# EasyEDA Pro project ProPrj_Motor Driver Board v5.3.7.epro, board PCB1
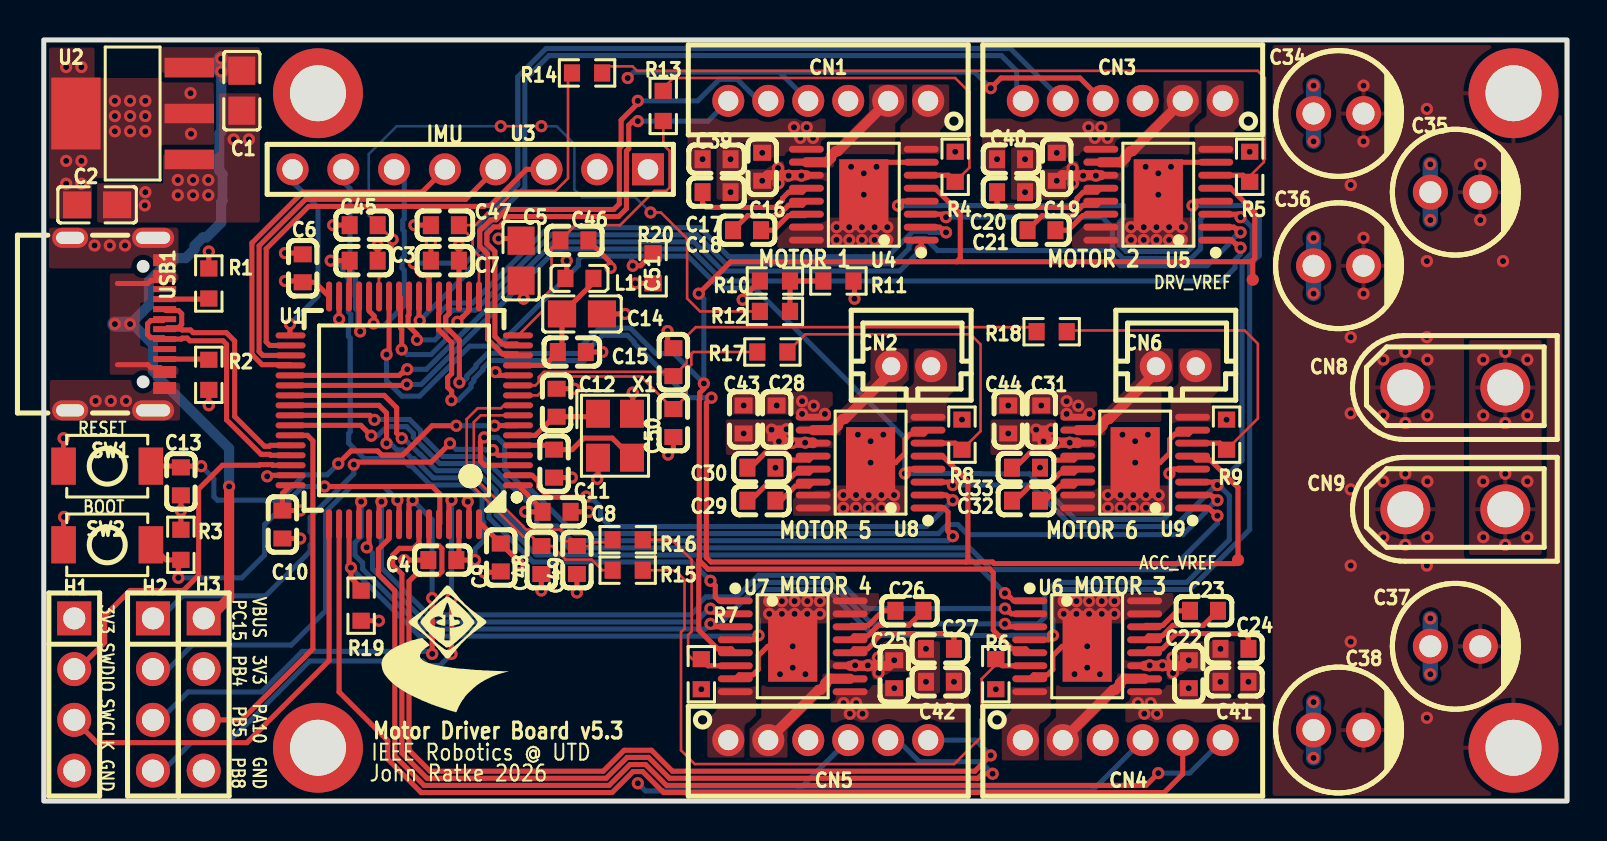
[diagram p8: board, top side]
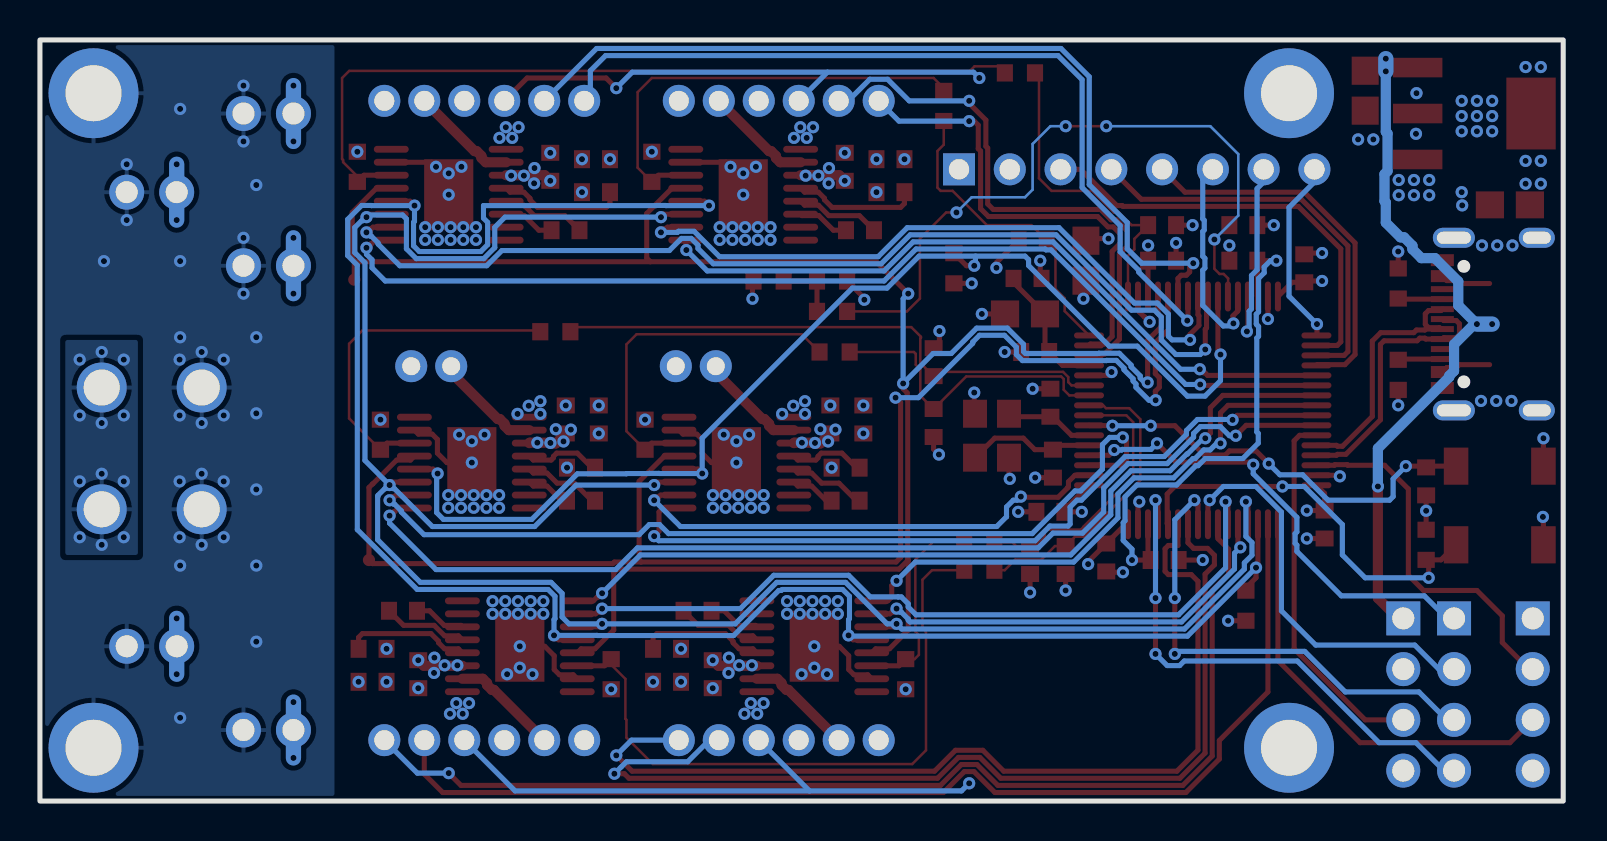
[diagram p9: board, bottom side, seen from below]

Outline 76.2 x 38.1 mm; copper layers: Top Layer, Inner1, Inner2, Bottom Layer. Coordinates in mm from the lower left corner of the outline.
Outline path: rectangle 0,38.1 76.2,0
Stack: Top Layer 0.035mm Outer layer thickness 1oz / Dielectric1 0.2104mm 7628 RC49% 8.6mil / Inner1 0.0152mm Inner layer thickness / Dielectric2 1.065mm 1.1mm H/HOZ Copper / Inner2 0.0152mm Inner layer thickness / Dielectric3 0.2104mm 7628 RC49% 8.6mil / Bottom Layer 0.035mm Outer layer thickness 1oz

## Design rules (mm)
net USB_DN: DP1
net USB_DP: DP1
template: Custom Config
spacing copperThickness1oz (default): track to track 0.102, other pairs 0.152 to 0.3
spacing copperThickness2oz: track to track 0.203, other pairs 0.152 to 0.3
track width copperThickness1oz (default): min 0.127, default 0.254, max 2.54
track width copperThickness2oz: min 0.203, default 0.254, max 2.54
differential pair differentialPair (default): width min 0.127, default 0.254, max 2.54; gap min 0.152, default 0.152
via viaSize (default): diameter min 0.5, default 0.61, max 10; hole min 0.3, default 0.305, max 6.3
pour e2389 uses throughhole
pour e4841 uses throughhole
pour e2168 uses throughhole
pour e1991 uses throughhole

## Placement (name value [footprint] x y rotation side)
C1  10uF  [C0805]  9.91 35.56 90 top
C2  10uF  [C0805]  2.67 29.84 180 top
C3  2.2uF  [C0603]  16 27.05 180 top
C4  2.2uF  [C0603]  19.94 12.06 180 top
C5  10uF  [C0805]  23.88 27.05 270 top
C6  100nF  [C0603]  12.95 26.67 270 top
C7  100nF  [C0603]  20.07 27.05 0 top
C8  100nF  [C0603]  25.65 14.48 180 top
C9  100nF  [C0603]  22.86 12.19 90 top
C10  100nF  [C0603]  11.94 13.84 90 top
C11  22pF  [C0603]  25.53 16.89 90 top
C12  22pF  [C0603]  25.65 19.94 90 top
C13  100nF  [C0603]  6.86 16 270 top
C14  10uF  [C0805]  26.92 24.38 180 top
C15  100nF  [C0603]  26.42 22.48 180 top
C16  100nF  [C0603]  35.94 31.75 90 top
C17  22nF  [C0603]  35.18 28.57 180 top
C18  100nF  [C0603]  33.66 30.48 0 top
C19  100nF  [C0603]  50.67 31.75 90 top
C20  22nF  [C0603]  49.91 28.57 180 top
C21  100nF  [C0603]  48.39 30.48 0 top
C22  100nF  [C0603]  57.28 6.35 270 top
C23  22nF  [C0603]  58.04 9.52 0 top
C24  100nF  [C0603]  59.56 7.62 180 top
C25  100nF  [C0603]  42.54 6.35 270 top
C26  22nF  [C0603]  43.31 9.52 0 top
C27  100nF  [C0603]  44.83 7.62 180 top
C28  100nF  [C0603]  36.66 19.1 90 top
C29  22nF  [C0603]  35.9 15.04 180 top
C30  100nF  [C0603]  35.9 16.69 0 top
C31  100nF  [C0603]  49.9 19.1 90 top
C32  22nF  [C0603]  49.14 15.04 180 top
C33  100nF  [C0603]  49.14 16.69 0 top
C34  470uF  [CAP-TH_BD6.3-P2.50-D0.6-FD-1]  64.77 34.42 0 top
C35  470uF  [CAP-TH_BD6.3-P2.50-D0.6-FD-1]  70.61 30.48 0 top
C36  470uF  [CAP-TH_BD6.3-P2.50-D0.6-FD-1]  64.77 26.8 0 top
C37  470uF  [CAP-TH_BD6.3-P2.50-D0.6-FD-1]  70.61 7.75 0 top
C38  470uF  [CAP-TH_BD6.3-P2.50-D0.6-FD-1]  64.77 3.56 0 top
C39  1uF  [C0603]  33.66 32.13 0 top
C40  1uF  [C0603]  48.39 32.13 0 top
C41  1uF  [C0603]  59.56 5.97 180 top
C42  1uF  [C0603]  44.83 5.97 180 top
C43  1uF  [C0603]  35.01 19.1 270 top
C44  1uF  [C0603]  48.25 19.1 270 top
C45  100nF  [C0603]  16 28.83 0 top
C46  100nF  [C0603]  26.54 28.07 180 top
C47  100nF  [C0603]  20.07 28.83 0 top
C48  100nF  [C0603]  24.89 12.06 90 top
C49  100nF  [C0603]  26.67 12.06 90 top
C50  100nF  [C0603]  31.5 18.92 90 top
C51  100nF  [C0603]  31.5 21.97 270 top
CN1  B6B-PH-K-S(LF)(SN)  [CONN-TH_B6B-PH-K-S]  39.24 35.05 0 top
CN2  B2B-PH-K-S(LF)(SN)  [CONN-TH_B2B-PH-K-S]  43.39 21.77 0 top
CN3  B6B-PH-K-S(LF)(SN)  [CONN-TH_B6B-PH-K-S]  53.97 35.05 0 top
CN4  B6B-PH-K-S(LF)(SN)  [CONN-TH_B6B-PH-K-S]  53.97 3.05 180 top
CN5  B6B-PH-K-S(LF)(SN)  [CONN-TH_B6B-PH-K-S]  39.24 3.05 180 top
CN6  B2B-PH-K-S(LF)(SN)  [CONN-TH_B2B-PH-K-S]  56.63 21.77 0 top
CN8  XT30UPB-M  [CONN-TH_XT30UPB-M]  70.61 20.7 0 top
CN9  XT30UPB-M  [CONN-TH_XT30UPB-M]  70.61 14.6 0 top
H1  PZ254V-11-04P  [HDR-TH_4P-P2.54-V-M]  1.52 5.33 270 top
H2  PZ254V-11-04P  [HDR-TH_4P-P2.54-V-M]  5.46 5.33 270 top
H3  PZ254V-11-04P  [HDR-TH_4P-P2.54-V-M]  8 5.33 270 top
L1  BLM18KG601SN1D  [L0603]  26.8 26.16 0 top
NOREF  -  [Pad_e130]  13.72 2.67 0 top
NOREF#2  -  [Pad_e140]  73.52 35.43 0 top
NOREF#3  -  [Pad_e1721]  60.48 26.1 0 top
NOREF#4  -  [Pad_e139]  13.72 35.43 0 top
NOREF#5  -  [Pad_e141]  73.52 2.67 0 top
NOREF#6  -  [Pad_e1714]  59.74 12.06 0 top
R1  5.1kΩ  [R0603]  8.25 25.91 90 top
R2  5.1kΩ  [R0603]  8.25 21.34 270 top
R3  5.1kΩ  [R0603]  6.86 12.83 90 top
R4  1kΩ  [R0603]  45.59 31.75 270 top
R5  1kΩ  [R0603]  60.32 31.75 270 top
R6  1kΩ  [R0603]  47.62 6.35 90 top
R7  1kΩ  [R0603]  32.89 6.35 90 top
R8  1kΩ  [R0603]  45.93 18.34 270 top
R9  1kΩ  [R0603]  59.17 18.34 270 top
R10  22kΩ  [R0603]  36.58 26.03 0 top
R11  100kΩ  [R0603]  39.75 26.03 0 top
R12  1kΩ  [R0603]  36.58 24.51 180 top
R13  1kΩ  [R0603]  30.99 34.8 90 top
R14  1kΩ  [R0603]  27.18 36.45 0 top
R15  1kΩ  [R0603]  29.21 11.56 0 top
R16  1kΩ  [R0603]  29.21 13.08 0 top
R17  1kΩ  [R0603]  36.45 22.48 0 top
R18  1kΩ  [R0603]  50.42 23.49 0 top
R19  5.1kΩ  [R0603]  15.88 9.78 90 top
R20  5.1kΩ  [R0603]  30.48 26.67 90 top
SW1  TS-1088-AR02016  [SW-SMD_L3.9-W3.0-P4.45]  3.17 16.76 0 top
SW2  TS-1088-AR02016  [SW-SMD_L3.9-W3.0-P4.45]  3.17 12.83 0 top
U1  STM32H562RGT6  [LQFP-64_L10.0-W10.0-P0.50-LS12.0-BL]  18.03 19.56 90 top
U2  AMS1117-3.3  [SOT-223-4_L6.5-W3.5-P2.30-LS7.0-BR]  4.44 34.42 0 top
U3  B25420220-8PB0513-H85C32  [HDR-TH_B25420220-8PB0513-H85C32]  21.34 31.62 180 top
U4  DRV8874PWPR  [HTSSOP-16_L5.0-W4.4-P0.65-LS6.4-BL-EP]  41.02 30.35 90 top
U5  DRV8874PWPR  [HTSSOP-16_L5.0-W4.4-P0.65-LS6.4-BL-EP]  55.75 30.35 90 top
U6  DRV8874PWPR  [HTSSOP-16_L5.0-W4.4-P0.65-LS6.4-BL-EP]  52.2 7.75 270 top
U7  DRV8874PWPR  [HTSSOP-16_L5.0-W4.4-P0.65-LS6.4-BL-EP]  37.47 7.75 270 top
U8  DRV8874PWPR  [HTSSOP-16_L5.0-W4.4-P0.65-LS6.4-BL-EP]  41.36 16.94 90 top
U9  DRV8874PWPR  [HTSSOP-16_L5.0-W4.4-P0.65-LS6.4-BL-EP]  54.6 16.94 90 top
USB1  TYPE-C16PIN  [USB-C-SMD_TYPE-C16PIN]  3.68 23.88 270 top
X1  25MHz  [CRYSTAL-SMD_4P-L3.2-W2.5-BL]  28.57 18.29 270 top

## Footprints (pads in the part's own frame, mm; a bottom-side part is the same pattern mirrored in y, then rotated)
C0603
  rect 0.8x0.9 smd: 1(-0.7,0) 2(0.7,0)
C0805
  rect 1.41x1.35 smd: 1(-1,0) 2(1,0)
CAP-TH_BD6.3-P2.50-D0.6-FD-1
  round 1.75 hole 1.1: 1(-1.25,0) 2(1.25,0)
CONN-TH_B2B-PH-K-S
  round 1.6 hole 0.9: 1(1,0) 2(-1,0)
CONN-TH_B6B-PH-K-S
  round 1.6 hole 1: 1(5,0) 2(3,0) 3(1,0) 4(-1,0) 5(-3,0) 6(-5,0)
CONN-TH_XT30UPB-M
  round 2.5 hole 1.8: 1(-2.5,0) 2(2.5,0)
CRYSTAL-SMD_4P-L3.2-W2.5-BL
  rect 1.4x1.2 smd: 1(-1.1,-0.85) 2(1.1,-0.85) 3(1.1,0.85) 4(-1.1,0.85)
HDR-TH_4P-P2.54-V-M
  rect 1.7x1.7 hole 1.1: 1(-3.81,0)
  round 1.7 hole 1.1: 2(-1.27,0) 3(1.27,0) 4(3.81,0)
HDR-TH_B25420220-8PB0513-H85C32
  rect 1.6x1.6 hole 1.02: 1(-8.89,0)
  round 1.6 hole 1.02: 2(-6.35,0) 3(-3.81,0) 4(-1.27,0) 5(1.27,0) 6(3.81,0) 7(6.35,0) 8(8.89,0)
HTSSOP-16_L5.0-W4.4-P0.65-LS6.4-BL-EP
  oval 0.343x1.746 smd: 1(-2.275,-2.873) 2(-1.625,-2.873) 3(-0.975,-2.873) 4(-0.325,-2.873) 5(0.325,-2.873) 6(0.975,-2.873) 7(1.625,-2.873) 8(2.275,-2.873) 9(2.275,2.873) 10(1.625,2.873) 11(0.975,2.873) 12(0.325,2.873) 13(-0.325,2.873) 14(-0.975,2.873) 15(-1.625,2.873) 16(-2.275,2.873)
  rect 3.55x2.46 smd: 17(0,0)
L0603
  rect 0.8x0.864 smd: 1(-0.7,0) 2(0.7,0)
LQFP-64_L10.0-W10.0-P0.50-LS12.0-BL
  oval 0.3x1.5 smd: 1(-3.75,-5.688) 2(-3.25,-5.688) 3(-2.75,-5.688) 4(-2.25,-5.688) 5(-1.75,-5.688) 6(-1.25,-5.688) 7(-0.75,-5.688) 8(-0.25,-5.688) 9(0.25,-5.688) 10(0.75,-5.688) 11(1.25,-5.688) 12(1.75,-5.688) 13(2.25,-5.688) 14(2.75,-5.688) 15(3.25,-5.688) 16(3.75,-5.688) 33(3.75,5.688) 34(3.25,5.688) 35(2.75,5.688) 36(2.25,5.688) 37(1.75,5.688) 38(1.25,5.688) 39(0.75,5.688) 40(0.25,5.688) 41(-0.25,5.688) 42(-0.75,5.688) 43(-1.25,5.688) 44(-1.75,5.688) 45(-2.25,5.688) 46(-2.75,5.688) 47(-3.25,5.688) 48(-3.75,5.688)
  oval 1.5x0.3 smd: 17(5.7,-3.738) 18(5.7,-3.238) 19(5.7,-2.738) 20(5.7,-2.238) 21(5.7,-1.738) 22(5.7,-1.238) 23(5.7,-0.739) 24(5.7,-0.238) 25(5.7,0.262) 26(5.7,0.762) 27(5.7,1.262) 28(5.7,1.762) 29(5.7,2.261) 30(5.7,2.762) 31(5.7,3.261) 32(5.7,3.762) 49(-5.7,3.762) 50(-5.7,3.261) 51(-5.7,2.762) 52(-5.7,2.261) 53(-5.7,1.762) 54(-5.7,1.262) 55(-5.7,0.762) 56(-5.7,0.262) 57(-5.7,-0.238) 58(-5.7,-0.739) 59(-5.7,-1.238) 60(-5.7,-1.738) 61(-5.7,-2.238) 62(-5.7,-2.738) 63(-5.7,-3.238) 64(-5.7,-3.738)
Pad_e130
  round 4.501 hole 2.799: 1(0,0)
Pad_e139
  round 4.501 hole 2.799: 1(0,0)
Pad_e140
  round 4.501 hole 2.799: 1(0,0)
Pad_e141
  round 4.501 hole 2.799: 1(0,0)
Pad_e1714
  round 0.61 smd: TP1(0,0)
Pad_e1721
  round 0.61 smd: TP2(0,0)
R0603
  rect 0.806x0.864 smd: 1(-0.753,0) 2(0.753,0)
SOT-223-4_L6.5-W3.5-P2.30-LS7.0-BR
  rect 2.47x0.98 smd: 1(2.835,-2.3) 2(2.835,0) 3(2.835,2.3)
  rect 2.47x3.6 smd: 4(-2.835,0)
SW-SMD_L3.9-W3.0-P4.45
  rect 1.23x1.86 smd: 1(-2.185,0) 2(2.185,0)
USB-C-SMD_TYPE-C16PIN
  oval 1x2.1 hole 0.6x1.7: 1(-4.32,1.788) 2(4.32,1.788)
  oval 1x1.8 hole 0.6x1.4: 3(-4.32,-2.362) 4(4.32,-2.362)
  rect 0.6x1.15 smd: A1B12(-3.2,2.362) A4B9(-2.4,2.362) B1A12(3.2,2.362) B4A9(2.4,2.362)
  rect 0.3x1.15 smd: A5(-1.25,2.362) A6(-0.25,2.362) A7(0.25,2.362) A8(1.25,2.362) B5(1.75,2.362) B6(0.75,2.362) B7(-0.75,2.362) B8(-1.75,2.362)

## Nets
3V3: C2.2 C5.2 C6.2 C7.2 C8.2 C9.2 C10.2 CN1.4 CN3.4 CN4.4 CN5.4 H1.1 H3.2 L1.1 R19.1 R20.1 SW2.1 U1.1 U1.19 U1.32 U1.48 U1.64 U2.2 U2.4 U3.1
3V3A: C14.2 C15.2 L1.2 U1.13
GND: C1.1 C2.1 C3.1 C4.2 C5.1 C6.1 C7.1 C8.1 C9.1 C10.1 C11.1 C12.2 C13.2 C14.1 C15.1 C16.2 C19.2 C22.2 C25.2 C28.2 C31.2 C34.2 C35.2 C36.2 C37.2 C38.2 C39.1 C40.1 C41.1 C42.1 C43.1 C44.1 C45.1 C46.1 C47.1 C48.1 C49.1 C50.1 C51.1 CN1.3 CN3.3 CN4.3 CN5.3 CN8.1 CN9.1 H1.4 H3.4 NOREF.1 NOREF#2.1 NOREF#4.1 NOREF#5.1 R1.2 R2.2 R3.2 R4.1 R5.1 R6.1 R7.1 R8.1 R9.1 R10.1 SW1.1 U1.12 U1.18 U1.31 U1.47 U1.63 U2.1 U3.2 U4.7 U4.9 U4.15 U4.16 U4.17 U5.7 U5.9 U5.15 U5.16 U5.17 U6.7 U6.9 U6.15 U6.16 U6.17 U7.7 U7.9 U7.15 U7.16 U7.17 U8.7 U8.9 U8.15 U8.16 U8.17 U9.7 U9.9 U9.15 U9.16 U9.17 USB1.1 USB1.2 USB1.3 USB1.4 USB1.A1B12 USB1.B1A12 X1.2 X1.4
VBATT: C16.1 C18.2 C19.1 C21.2 C22.1 C24.2 C25.1 C27.2 C28.1 C30.2 C31.1 C33.2 C34.1 C35.1 C36.1 C37.1 C38.1 C39.2 C40.2 C41.2 C42.2 C43.2 C44.2 CN8.2 CN9.2 R11.2 U4.11 U5.11 U6.11 U7.11 U8.11 U9.11
VBATT_SENSE: C45.2 R12.2 U1.27
VBUS: C1.2 H3.1 U2.3 USB1.A4B9 USB1.B4A9
$2I4343\$1N607: C17.1 U4.14
$2I4343\$1N611: C17.2 U4.13
$2I4343\$1N695: C18.1 U4.12
$2I4343\OUT1: CN1.1 U4.8
$2I4343\OUT2: CN1.2 U4.10
$2I4381\$1N607: C20.1 U5.14
$2I4381\$1N611: C20.2 U5.13
$2I4381\$1N695: C21.1 U5.12
$2I4381\OUT1: CN3.1 U5.8
$2I4381\OUT2: CN3.2 U5.10
$2I4419\$1N607: C23.1 U6.14
$2I4419\$1N611: C23.2 U6.13
$2I4419\$1N695: C24.1 U6.12
$2I4419\OUT1: CN4.1 U6.8
$2I4419\OUT2: CN4.2 U6.10
$2I4457\$1N607: C26.1 U7.14
$2I4457\$1N611: C26.2 U7.13
$2I4457\$1N695: C27.1 U7.12
$2I4457\OUT1: CN5.1 U7.8
$2I4457\OUT2: CN5.2 U7.10
$2I4533\$1N607: C29.1 U8.14
$2I4533\$1N611: C29.2 U8.13
$2I4533\$1N695: C30.1 U8.12
$2I4533\OUT1: CN2.1 U8.8
$2I4533\OUT2: CN2.2 U8.10
$2I4563\$1N607: C32.1 U9.14
$2I4563\$1N611: C32.2 U9.13
$2I4563\$1N695: C33.1 U9.12
$2I4563\OUT1: CN6.1 U9.8
$2I4563\OUT2: CN6.2 U9.10
ACC_FAULT: R20.2 U1.26 U8.4 U9.4
ACC_VREF: NOREF#6.TP1 U1.21 U8.5 U9.5
BOOT0: R3.1 SW2.2 U1.60
DRV_FAULT: R19.2 U1.51 U4.4 U5.4 U6.4 U7.4
DRV_VREF: NOREF#3.TP2 U1.20 U4.5 U5.5 U6.5 U7.5
GPIO1: H2.1 U1.4
GPIO2: H2.2 U1.56
GPIO3: H2.3 U1.57
GPIO4: H2.4 U1.61
GPIO5: H3.3 U1.43
HSE_IN: C11.2 U1.5 X1.3
HSE_OUT: C12.1 U1.6 X1.1
IMU_CS: U1.28 U3.6
IMU_INT: U1.29 U3.7
IMU_MISO: U1.35 U3.4
IMU_MOSI: U1.36 U3.5
IMU_RST: U1.33 U3.8
IMU_SCK: U1.34 U3.3
M1_EN: U1.37 U4.1
M1_ENCA: CN1.5 U1.14
M1_ENCB: CN1.6 U1.15
M1_IPROPI: C46.2 R13.1 U1.16
M1_PH: U1.24 U4.2
M2_EN: U1.38 U5.1
M2_ENCA: CN3.5 U1.22
M2_ENCB: CN3.6 U1.23
M2_IPROPI: C47.2 R14.1 U1.17
M2_PH: U1.25 U5.2
M3_EN: U1.39 U6.1
M3_ENCA: CN4.5 U1.50
M3_ENCB: CN4.6 U1.55
M3_IPROPI: C48.2 R15.1 U1.9
M3_PH: U1.54 U6.2
M4_EN: U1.40 U7.1
M4_ENCA: CN5.5 U1.58
M4_ENCB: CN5.6 U1.59
M4_IPROPI: C49.2 R16.1 U1.8
M4_PH: U1.53 U7.2
M5_EN: U1.41 U8.1
M5_IPROPI: C50.2 R17.1 U1.10
M5_PH: U1.2 U8.2
M6_EN: U1.42 U9.1
M6_IPROPI: C51.2 R18.1 U1.11
M6_PH: U1.3 U9.2
NRST: C13.1 SW1.2 U1.7
NSLEEP: U1.52 U4.3 U5.3 U6.3 U7.3 U8.3 U9.3
SWCLK: H1.3 U1.49
SWDIO: H1.2 U1.46
USB_DN: U1.44 USB1.A7 USB1.B7
USB_DP: U1.45 USB1.A6 USB1.B6
VCAP: C3.2 C4.1 U1.30 U1.62
$1N5317: R2.1 USB1.B5
$1N5479: R1.1 USB1.A5
$2N8125: R4.2 R13.2 U4.6
$2N8729: R5.2 R14.2 U5.6
$2N8744: R6.2 R15.2 U6.6
$2N8759: R7.2 R16.2 U7.6
$2N8774: R8.2 R17.2 U8.6
$2N8789: R9.2 R18.2 U9.6
$2N8796: R10.2 R11.1 R12.1

Pads without a net: USB1 A8 B8

## Via types
v1: diameter 0.61, hole 0.305, Top Layer to Bottom Layer, 380 vias

## Routing (per net, layer and track width the routed paths; a pad name or vN(x,y) marks a point on that pad's centre or on a via; arc(x,y) is an arc through that point)
3V3: length 75.1
  Top Layer w0.254: L1.1 26.1,26.22 26.16,26.29 v1(26.16,27.05) ; C5.2 24,25.92 v1(24,25.15) ; CN3.4 51.83,36.19 47.88,36.19 v1(47.37,35.69) ; R20.1 v1(29.59,25.92) ; U1.48 11.94,15.4 C10.2 v1(12.83,14.54) ; U1.64 21.89,13.86 23.77,11.98 v1(23.77,11.86) ; R19.1 v1(16.76,9.03) ; U1.19 20.77,27.04 C7.2 v1(20.77,27.81) ; SW2.1 0.99,14.2 v1(1.02,14.22) ; v1(12.06,26.03) 12.89,26.03 C6.2 13.56,25.97 U1.32 ; v1(24.08,14.48) C8.2 24.95,14.58 U1.1
  Bottom Layer w0.254: 36.81,36.49 29.5,36.49 v1(29.21,36.19) ; 36.81,36.49 CN1.4 ; 36.81,36.49 46.57,36.49 v1(47.37,35.69) ; CN4.4 52.44,0.51 37.7,0.51 ; 37.7,0.51 30.1,0.51 v1(29.72,0.89) ; 37.7,0.51 CN5.4
  vias: v1(1.12,36.74) v1(1.12,32.05) v1(1.12,30.9) v1(1.88,36.74) v1(1.88,32.05) v1(1.88,30.9) v1(3.56,35.05) v1(3.56,34.29) v1(3.56,33.53) v1(4.32,35.05) v1(4.32,34.29) v1(4.32,33.53) v1(5.08,35.05) v1(5.08,34.29) v1(5.08,33.53) v1(7.34,35.44) v1(7.37,33.4)
3V3A: length 6.7
  Top Layer w0.254: U1.13 25.04,21.81 C15.2 25.92,22.69 C14.2 27.5,25.96 L1.2
GND: length 53.5
  Top Layer w0.254: 31.5,18.22 31.5,17.61 v1(31.23,17.35) ; U5.7 56.62,31.98 v1(56.39,31.75) ; v1(52.2,7.75) 50.95,7.75 50.48,7.27 50.48,6.59 50.21,6.32 49.52,6.32 U6.7 ; U4.7 41.88,31.98 v1(41.66,31.75) ; X1.4 29.46,19.43 v1(29.46,20.45) ; C51.1 31.21,22.96 v1(31.21,23.53) ; C8.1 v1(27.27,14.48) ; X1.2 27.72,16.17 v1(27.69,16.13) ; 25.53,20.64 v1(26.54,20.64) ; U1.63 21.27,14.92 v1(21.21,14.99) ; U9.7 57.27,18.37 56.58,18.37 56.32,18.1 56.32,17.41 55.84,16.94 v1(54.6,16.94) ; C48.1 v1(24.89,10.54) ; R1.2 v1(8.25,27.51) ; C3.1 v1(16.7,27.81) ; U1.12 22.76,21.31 v1(22.6,21.48) ; v1(8.25,19.81) R2.2 ; v1(20.69,23.99) 20.93,24.23 20.95,24.23 21.2,24.48 21.2,24.5 21.27,24.57 U1.18 ; C7.1 v1(19.37,27.94) ; SW1.1 v1(0.99,18.16) ; v1(27.94,22.48) C15.1 ; C49.1 v1(26.67,10.44) ; v1(34.96,25.09) 34.93,25.12 34.93,25.15 R10.1 ; U7.7 34.79,6.32 35.48,6.32 35.74,6.59 35.74,7.27 36.22,7.75 v1(37.47,7.75) ; v1(22.03,11.45) 22.82,11.45 C9.1 ; C47.1 v1(18.54,28.83) ; C46.1 28.35,26.96 v1(28.35,26.69) ; v1(11.18,16.26) 11.23,16.31 U1.47 ; C11.1 v1(26.42,16.19) ; v1(29.08,24.38) C14.1 ; v1(12.06,27.43) 12.89,27.43 C6.1 ; C5.1 23.77,28.16 v1(22.75,28.16) ; R3.2 v1(6.86,14.53) C13.2 ; C4.2 v1(18.03,12.06) ; U8.7 44.03,18.37 43.35,18.37 43.08,18.1 43.08,17.41 42.61,16.94 v1(41.36,16.94) ; U1.31 v1(14.77,24.13) ; 11.94,13.14 v1(12.83,13.14) ; C45.1 v1(14.48,28.83)
  vias: v1(2.54,27.81) v1(2.59,20.03) v1(3.3,27.81) v1(3.35,20.03) v1(4.06,27.81) v1(4.11,20.03) v1(5.08,30.48) v1(5.05,29.82) v1(6.71,31.09) v1(6.71,30.33) v1(7.47,31.09) v1(7.47,30.33) v1(8.23,31.09) v1(8.23,30.33) v1(9.5,33.12) v1(10.26,33.12) v1(32.89,5.6) v1(32.96,32.13) v1(35.01,19.8) v1(35.94,32.45) v1(36.29,10.01) v1(36.29,9.37) v1(36.66,19.8) v1(36.83,6.35) v1(36.92,10.01) v1(36.92,9.37) v1(37.53,33.73) v1(37.47,6.68) v1(37.56,10.01) v1(37.56,9.37) v1(37.85,33.2) v1(37.93,20.02) v1(37.93,19.38) v1(38.1,6.35) v1(38.16,33.73) v1(38.19,10.01) v1(38.19,9.37) v1(38.48,33.2) v1(38.52,19.79) v1(38.83,10.01) v1(38.83,9.37) v1(39.07,19.38) v1(39.66,28.73) v1(39.66,28.09) v1(40,15.32) v1(40,14.68) v1(40,4.9) v1(40.29,28.73) v1(40.29,28.09) v1(40.32,4.37) v1(40.39,31.75) v1(40.63,15.32) v1(40.63,14.68) v1(40.64,4.9) v1(40.73,18.34) v1(40.93,28.73) v1(40.93,28.09) v1(41.02,31.42) v1(41.02,30.35) v1(40.96,4.37) v1(41.27,15.32) v1(41.27,14.68) v1(41.36,18.01) v1(41.56,28.73) v1(41.56,28.09) v1(41.9,15.32) v1(41.9,14.68) v1(42,18.34) v1(42.2,28.73) v1(42.2,28.09) v1(42.54,15.32) v1(42.54,14.68) v1(42.54,5.65) v1(45.53,5.97) v1(45.59,32.5) v1(45.93,19.09) v1(47.62,5.6) v1(47.69,32.13) v1(48.25,19.8) v1(49.9,19.8) v1(50.67,32.45) v1(51.02,10.01) v1(51.02,9.37) v1(51.17,20.02) v1(51.17,19.38) v1(51.56,6.35) v1(51.66,10.01) v1(51.66,9.37) v1(51.75,19.79) v1(52.2,6.68) v1(52.26,33.73) v1(52.31,19.38) v1(52.29,10.01) v1(52.29,9.37) v1(52.58,33.2) v1(52.83,6.35) v1(52.9,33.73) v1(52.93,10.01) v1(52.93,9.37) v1(53.21,33.2) v1(53.23,15.32) v1(53.23,14.68) v1(53.56,10.01) v1(53.56,9.37) v1(53.87,15.32) v1(53.87,14.68) v1(53.96,18.34) v1(54.39,28.73) v1(54.39,28.09) v1(54.5,15.32) v1(54.5,14.68) v1(54.6,18.01) v1(54.74,4.9) v1(55.02,28.73) v1(55.02,28.09) v1(55.12,31.75) v1(55.14,15.32) v1(55.14,14.68) v1(55.05,4.37) v1(55.23,18.34) v1(55.37,4.9) v1(55.66,28.73) v1(55.66,28.09) v1(55.69,4.37) v1(55.75,31.42) v1(55.75,30.35) v1(55.77,15.32) v1(55.77,14.68) v1(56.29,28.73) v1(56.29,28.09) v1(56.93,28.73) v1(56.93,28.09) v1(57.28,5.65) v1(59.17,19.09) v1(60.32,32.5) v1(60.26,5.97) v1(65.38,30.84) v1(65.38,23.22) v1(65.38,19.41) v1(65.38,15.6) v1(65.38,11.79) v1(65.38,7.98) v1(66.02,35.81) v1(66.02,33.02) v1(66.02,28.19) v1(66.02,25.4) v1(67.01,22.1) v1(67.01,19.3) v1(67.01,16) v1(67.01,13.21) v1(68.11,22.48) v1(68.11,18.92) v1(68.11,16.38) v1(68.11,12.83) v1(69.19,34.65) v1(69.19,27.03) v1(69.19,23.22) v1(69.22,22.1) v1(69.22,19.3) v1(69.22,16) v1(69.22,13.21) v1(69.19,11.79) v1(69.19,4.17) v1(71.86,31.88) v1(71.86,29.08) v1(73,27.03)
VBATT: length 28.3
  Top Layer w0.254: R11.2 40.56,25.98 v1(40.56,25.15)
  Top Layer w0.508: C28.1 37.16,17.9 37.32,17.9 37.34,17.93 v1(37.43,17.93) 37.44,17.94 v1(38.09,17.94) 38.47,17.94 U8.11 ; U4.11 36.22,31.33 v1(35.94,31.05) ; U9.11 51.7,17.94 v1(51.32,17.94) 50.68,17.94 v1(50.67,17.93) 50.58,17.93 50.55,17.9 50.4,17.9 C31.1 ; U7.11 42.27,6.77 v1(42.54,7.05) ; U5.11 50.95,31.33 v1(50.67,31.05) ; U6.11 57,6.77 v1(57.28,7.05)
  Bottom Layer w0.762: v1(63.52,35.81) C34.1 v1(63.52,33.02) ; v1(63.52,28.19) C36.1 v1(63.52,25.4) ; v1(63.52,2.16) C38.1 v1(63.52,4.95) ; v1(69.36,31.88) C35.1 v1(69.36,29.08) ; v1(69.36,6.35) C37.1 v1(69.36,9.14)
  vias: v1(34.35,32.13) v1(34.35,30.48) v1(35.01,18.4) v1(36.41,18.59) v1(36.6,16.69) v1(36.73,31.69) v1(36.75,30.92) v1(36.78,18) v1(37.16,18.61) v1(37.26,31.31) v1(37.9,31.31) v1(40.59,6.79) v1(41.22,6.79) v1(41.74,7.18) v1(41.76,6.41) v1(44.13,7.62) v1(44.13,5.97) v1(48.25,18.4) v1(49.09,32.13) v1(49.09,30.48) v1(49.64,18.59) v1(49.84,16.69) v1(50.01,18) v1(50.39,18.61) v1(51.46,31.69) v1(51.48,30.92) v1(51.99,31.31) v1(52.63,31.31) v1(55.32,6.79) v1(55.96,6.79) v1(56.47,7.18) v1(56.49,6.41) v1(58.86,7.62) v1(58.86,5.97) v1(72.01,22.1) v1(72.01,19.3) v1(72.01,16) v1(72.01,13.21) v1(73.11,22.48) v1(73.11,18.92) v1(73.11,16.38) v1(73.11,12.83) v1(74.22,22.1) v1(74.22,19.3) v1(74.22,16) v1(74.22,13.21)
VBATT_SENSE: length 36.2
  Top Layer w0.127: R12.2 32.83,24.51 32.18,25.16 32.18,28.15 30.87,29.46 v1(30.35,29.46) ; U1.27 16.76,25.27 16.76,26.16 16.99,26.39 17.19,26.39 17.45,26.64 v1(17.45,28.11) 16.73,28.83 C45.2 ; v1(24.89,33.78) v1(22.86,33.78)
  Bottom Layer w0.127: v1(30.35,29.46) 29.59,30.23 26.92,30.23 26.54,30.61 26.54,32.89 25.65,33.78 v1(24.89,33.78) ; v1(17.45,28.11) 16.26,29.31 16.26,32.38 17.65,33.78 v1(22.86,33.78)
VBUS: length 38.7
  Top Layer w0.254: USB1.A4B9 5.82,26.05 5.36,26.05 5.21,25.91 3.68,25.91 ; USB1.B4A9 5.82,21.7 5.36,21.7 5.21,21.84 3.68,21.84
  Top Layer w0.508: v1(9.27,15.75) 9.27,10.16 8.25,9.14
  Bottom Layer w0.508: v1(9.27,15.75) 9.27,17.65 5.7,21.22 5.7,21.29 5.46,21.53 5.46,22.86 4.44,23.88 ; v1(4.32,23.88) 5.25,24.81 5.25,26.01 6.42,27.18 7.1,27.18 7.54,27.62 7.54,27.8 7.96,28.22 8.14,28.22 8.88,28.96 8.88,29.97 8.94,30.03 8.94,31.38 8.79,31.54 8.79,33.42 8.88,33.5 v1(8.88,36.53)
  Bottom Layer w0.762: v1(8.88,37.16) v1(8.88,36.53) ; v1(3.56,23.88) v1(4.32,23.88)
$2I4343\$1N607: length 2.6
  Top Layer w0.254: C17.1 36.51,28.57 37.24,29.31 38.08,29.31 U4.14
$2I4343\$1N611: length 4.3
  Top Layer w0.254: C17.2 35.21,29.3 36.74,29.3 37.26,29.83 37.95,29.83 U4.13
$2I4343\$1N695: length 6.3
  Top Layer w0.254: C18.1 32.96,29.91 33.15,29.72 36.58,29.72 36.96,30.1 36.96,30.18 37.26,30.48 37.95,30.48 U4.12
$2I4343\OUT2: length 5.4
  Top Layer w0.508: U4.10 39.17,31.98 39.38,32.19 39.38,32.3 39.62,32.53 39.72,32.53 CN1.2
$2I4381\$1N607: length 2.6
  Top Layer w0.254: C20.1 51.24,28.57 51.97,29.31 52.81,29.31 U5.14
$2I4381\$1N611: length 4.3
  Top Layer w0.254: U5.13 52.68,29.83 51.99,29.83 51.47,29.3 49.94,29.3 C20.2
$2I4381\$1N695: length 6.3
  Top Layer w0.254: C21.1 47.69,29.91 47.88,29.72 51.31,29.72 51.69,30.1 51.69,30.18 51.99,30.48 52.68,30.48 U5.12
$2I4381\OUT2: length 5.4
  Top Layer w0.508: CN3.2 54.46,32.53 54.35,32.53 54.12,32.3 54.12,32.19 53.9,31.98 U5.10
$2I4419\$1N607: length 2.6
  Top Layer w0.254: C23.1 56.71,9.52 55.98,8.79 55.14,8.79 U6.14
$2I4419\$1N611: length 4.3
  Top Layer w0.254: 58.74,9.52 58.01,8.8 56.48,8.8 55.96,8.27 55.27,8.27 U6.13
$2I4419\$1N695: length 6.3
  Top Layer w0.254: 60.26,7.62 60.26,8.19 60.07,8.38 56.64,8.38 56.26,8 56.26,7.92 55.96,7.62 55.27,7.62 U6.12
$2I4419\OUT2: length 5.4
  Top Layer w0.508: U6.10 54.05,6.12 53.83,5.91 53.83,5.8 53.59,5.57 53.49,5.57 CN4.2
$2I4457\$1N607: length 2.6
  Top Layer w0.254: U7.14 40.41,8.79 41.25,8.79 41.98,9.52 C26.1
$2I4457\$1N611: length 4.3
  Top Layer w0.254: U7.13 40.54,8.27 41.23,8.27 41.75,8.8 43.28,8.8 44.01,9.52
$2I4457\$1N695: length 6.3
  Top Layer w0.254: 45.53,7.62 45.53,8.19 45.34,8.38 41.91,8.38 41.53,8 41.53,7.92 41.23,7.62 40.54,7.62 U7.12
$2I4457\OUT2: length 5.4
  Top Layer w0.508: CN5.2 38.76,5.57 38.86,5.57 39.1,5.8 39.1,5.91 39.32,6.12 U7.10
$2I4533\$1N607: length 2.3
  Top Layer w0.254: C29.1 36.87,15.04 37.6,15.77 38.29,15.77 U8.14
$2I4533\$1N611: length 3.9
  Top Layer w0.254: U8.13 38.29,16.42 37.6,16.42 37.09,15.91 36.23,15.91 35.36,15.04 C29.2
$2I4533\$1N695: length 3.9
  Top Layer w0.254: C30.1 35.36,16.69 36.08,17.42 37.12,17.42 37.28,17.25 37.28,17.18 37.39,17.07 38.29,17.07 U8.12
$2I4533\OUT2: length 5.4
  Top Layer w0.508: U8.10 39.51,18.57 39.72,18.78 39.72,18.89 39.96,19.12 40.06,19.12 42.58,21.64
$2I4563\$1N607: length 2.3
  Top Layer w0.254: U9.14 51.52,15.77 50.84,15.77 50.1,15.04 C32.1
$2I4563\$1N611: length 3.9
  Top Layer w0.254: C32.2 48.59,15.04 49.47,15.91 50.33,15.91 50.84,16.42 51.52,16.42 U9.13
$2I4563\$1N695: length 3.9
  Top Layer w0.254: U9.12 51.53,17.07 50.63,17.07 50.51,17.18 50.51,17.25 50.35,17.42 49.32,17.42 48.59,16.69 C33.1
$2I4563\OUT2: length 5.4
  Top Layer w0.508: 55.82,21.64 53.3,19.12 53.2,19.12 52.96,18.89 52.96,18.78 52.74,18.57 U9.10
ACC_FAULT: length 59.8
  Top Layer w0.254: v1(43.07,16.4) 43.29,16.62 U8.4 ; R20.2 29.85,26.8 v1(29.46,26.8) ; U1.26 17.27,22.48 v1(17.14,22.35) ; U9.4 56.53,16.62 v1(56.31,16.4)
  Bottom Layer w0.254: v1(56.31,16.4) 56.36,16.35 56.36,14.44 56.01,14.1 51.6,14.1 49.31,16.38 46.86,16.38 46.85,16.4 45.72,16.4 45.72,16.4 45.23,16.4 45.23,16.4 v1(43.07,16.4) 43.07,18.17 35.56,25.68 33.83,25.68 32.23,27.28 29.4,27.28 ; 29.4,27.28 26.92,27.28 26.75,27.1 26.75,26.81 22.71,22.77 21.31,22.77 18.8,20.27 17.92,20.27 17.14,21.04 v1(17.14,22.35) ; 29.4,27.28 29.4,26.86 v1(29.46,26.8)
ACC_VREF: length 69.8
  Top Layer w0.254: U8.5 44.96,17.27 46.23,16 46.23,12.06 46.13,11.97 ; v1(33.4,20.19) 33.15,19.94 33.15,12.19 33.37,11.97 46.13,11.97 ; v1(20.39,20.07) 20.41,20.08 20.41,20.51 20.21,20.71 20.21,21.2 20.41,21.4 20.41,22.94 19.75,23.6 19.75,24.38 19.77,24.4 U1.21 ; 46.13,11.97 47.47,11.97 47.55,11.89 59.56,11.89 NOREF#6.TP1 59.74,15.7 59.56,15.88 59.55,15.88 58.36,17.07 57.67,17.07 U9.5
  Bottom Layer w0.254: v1(33.4,20.19) 32.26,20.19 29.54,22.91 29.54,22.97 29.2,23.32 27.95,23.32 27.36,22.72 27.36,22.35 27.05,22.05 22.85,22.05 22.84,22.06 22.35,22.06 21.97,21.68 21.97,21.59 21.52,21.13 21.52,21.02 21.37,20.88 21.37,20.71 20.73,20.07 v1(20.39,20.07)
BOOT0: length 20.3
  Top Layer w0.254: SW2.2 6.11,12.07 R3.1 6.73,11.95 v1(6.73,11.18) ; v1(14.05,15.75) 19.43,15.75 19.81,15.37 19.81,13.9 U1.60
  Bottom Layer w0.254: v1(6.73,11.18) 9.91,11.18 11.05,12.32 11.05,13.84 12.95,15.75 v1(14.05,15.75)
DRV_FAULT: length 100.2
  Top Layer w0.254: R19.2 15.88,10.67 15.37,11.18 v1(15.37,11.68) 15.27,11.78 U1.51 ; U5.4 57.69,30.03 v1(57.46,29.81) ; v1(50.49,8.29) 50.26,8.07 U6.4 ; v1(35.75,8.29) 35.53,8.07 U7.4 ; U4.4 42.95,30.03 v1(42.73,29.81)
  Bottom Layer w0.254: v1(15.37,11.68) 18.8,8.25 35.71,8.25 v1(35.75,8.29) 35.75,9.08 35.7,9.13 35.7,10.25 36.05,10.59 39.07,10.59 39.12,10.54 39.24,10.54 41.5,8.29 48.32,8.29 48.33,8.29 v1(50.49,8.29) 50.49,9.08 50.44,9.13 50.44,10.25 50.78,10.59 57.33,10.59 60.32,13.59 60.32,26.82 60.81,27.31 60.81,29.12 60.11,29.81 59.63,29.81 59.62,29.81 v1(57.46,29.81) 57.46,29.02 57.51,28.97 57.51,27.8 57.23,27.51 54.15,27.51 53.81,27.85 53.81,28.97 54.01,29.18 54.01,29.81 45.38,29.81 45.38,29.81 44.89,29.81 44.89,29.81 v1(42.73,29.81)
DRV_VREF: length 98.2
  Top Layer w0.254: 32.77,12.06 32.79,12.09 32.79,20.09 32.82,20.11 32.82,20.43 33.02,20.64 v1(33.02,20.9) ; 32.77,12.06 33.22,11.61 47.32,11.61 47.5,11.43 47.5,8.56 48.44,7.62 49.12,7.62 U6.5 ; 32.77,12.06 32.77,8.56 33.7,7.62 34.39,7.62 U7.5 ; 60.48,27.08 60.4,27 45.67,27 ; 60.48,27.08 60.58,27.18 60.58,29.46 59.37,30.68 U5.5 ; 60.48,27.08 NOREF#3.TP2 ; 45.67,27 34.36,27 v1(32.77,25.4) ; 45.67,27 45.85,27.18 45.85,29.41 44.58,30.68 U4.5 ; U1.20 20.27,24.4 20.11,24.23 20.11,23.75 20.79,23.06 v1(20.79,20.95)
  Bottom Layer w0.254: v1(32.77,25.4) 33.02,25.15 v1(33.02,20.9) 31.52,22.4 30.61,22.4 29.35,23.67 27.8,23.67 27,22.87 27,22.5 26.9,22.4 23.24,22.4 23.23,22.42 22.21,22.42 21.62,21.82 21.62,21.74 21.16,21.28 21.16,21.17 20.95,20.95 v1(20.79,20.95)
GPIO1: length 23.5
  Top Layer w0.254: v1(22.46,17.57) 22.72,17.31 U1.4 ; v1(20.32,17.91) 19.38,16.97 15.7,16.97 15.57,16.84 v1(15.51,16.84)
  Bottom Layer w0.254: v1(22.46,17.57) 22.09,17.57 22.06,17.6 20.62,17.6 v1(20.32,17.91) ; v1(15.51,16.84) 15.51,16.38 13.32,14.2 13.32,13.47 13.41,13.38 13.41,12.9 13.32,12.81 13.32,12.5 11.1,10.27 6.95,10.27 5.82,9.14 H2.1
GPIO2: length 20.4
  Top Layer w0.254: U1.56 17.77,14.98 v1(17.69,15.06)
  Bottom Layer w0.254: v1(17.69,15.06) 17,15.75 15.38,15.75 14.1,14.47 14.1,9.52 12.38,7.81 7.43,7.81 6.22,6.6 H2.2
GPIO3: length 24.8
  Top Layer w0.254: U1.57 18.27,14.86 18.45,15.04 v1(18.45,15.06) ; v1(19.43,10.16) v1(19.43,7.37)
  Bottom Layer w0.254: v1(18.45,15.06) 19.43,14.08 v1(19.43,10.16) ; v1(19.43,7.37) 19.41,7.37 19.28,7.49 12.93,7.49 10.9,5.46 7.22,5.46 5.82,4.06 H2.3
GPIO4: length 26.5
  Top Layer w0.254: v1(20.4,15.06) 20.27,14.94 U1.61 ; v1(20.4,10.16) v1(20.4,7.37)
  Bottom Layer w0.254: v1(20.4,7.37) 19.81,6.78 19.19,6.78 18.96,7.01 13.3,7.01 9.21,2.92 7.37,2.92 5.97,1.52 H2.4 ; v1(20.4,15.06) v1(20.4,10.16)
GPIO5: length 18.3
  Top Layer w0.254: 8.25,4.06 9.91,4.06 13.46,7.62 13.46,18.03 13.19,18.31 U1.43
HSE_IN: length 6.4
  Top Layer w0.254: X1.3 29.02,17.59 29.02,17.59 28.44,18.17 27.01,18.17 26.43,17.59 C11.2 25.31,17.81 U1.5
HSE_OUT: length 4.5
  Top Layer w0.254: X1.1 27.58,19.24 25.53,19.24 24.6,18.31 U1.6
IMU_CS: length 10.7
  Top Layer w0.254: v1(16.5,23.91) 16.52,23.93 16.52,24.29 16.3,24.51 16.3,24.53 16.27,24.55 U1.28
  Bottom Layer w0.254: U3.6 18.03,31.11 18.03,29.15 17.96,29.07 17.96,28.59 18.03,28.51 18.03,27.27 17.92,27.17 17.92,26.68 18.03,26.57 18.03,24.81 17.01,23.78 16.63,23.78 v1(16.5,23.91)
IMU_INT: length 10.2
  Top Layer w0.254: U1.29 15.77,23.56 v1(15.82,23.51)
  Bottom Layer w0.254: v1(15.82,23.51) 15.71,23.62 15.71,24.52 15.6,24.64 15.6,26.31 15.32,26.59 15.32,30.66 14.99,30.99 U3.7
IMU_MISO: length 20.4
  Top Layer w0.254: U3.4 21.11,30.12 13.1,30.12 10.77,27.79 10.77,22.5 10.96,22.31 U1.35
IMU_MOSI: length 18.9
  Top Layer w0.254: U1.36 12.31,21.84 10.92,21.84 10.41,22.35 10.41,27.94 12.95,30.48 18.92,30.48 U3.5
IMU_RST: length 9.4
  Top Layer w0.254: v1(12.32,23.88) 12.32,23.33 U1.33
  Bottom Layer w0.254: v1(12.32,23.88) 13.72,25.27 13.72,29.72 12.45,30.99 U3.8
IMU_SCK: length 21.6
  Top Layer w0.254: U3.3 24.14,31.62 22.33,29.81 22.06,29.81 22.02,29.77 13.25,29.77 11.13,27.64 11.13,22.99 11.31,22.81 U1.34
M1_EN: length 35.8
  Top Layer w0.254: v1(43.87,27.58) 43.89,27.61 U4.1 ; U1.37 17.79,21.31 17.92,21.44 18,21.44 v1(18.18,21.62)
  Bottom Layer w0.254: v1(18.18,21.62) 19.14,21.62 25.52,27.99 32.52,27.99 33.97,26.54 42.82,26.54 v1(43.87,27.58)
M1_ENCA: length 27.9
  Top Layer w0.254: v1(29.72,35.05) 29.72,34.92 28.88,34.09 28.88,32.78 28.79,32.69 28.79,29.89 28.51,29.62 23.14,29.62 22.62,29.1 22.36,29.1 21.81,28.55 21.81,27.77 22.2,27.38 22.2,23.12 22.94,22.38 23.65,22.38 U1.14
  Bottom Layer w0.254: CN1.5 35.77,35.05 34.69,36.13 33.8,36.13 32.72,35.05 v1(29.72,35.05)
M1_ENCB: length 23.9
  Top Layer w0.254: U1.15 23.65,22.88 22.94,22.88 22.57,23.26 22.57,27.51 22.16,27.92 22.16,28.4 22.51,28.74 22.77,28.74 23.29,29.26 28.75,29.26 29.15,29.66 29.15,32.54 29.26,32.65 29.26,33.83 29.46,34.04 v1(29.72,34.04)
  Bottom Layer w0.254: v1(29.72,34.04) 33.23,34.04 CN1.6
M1_IPROPI: length 15.7
  Top Layer w0.127: U1.16 24.94,24.53 24.94,25.17 25.4,25.63 25.4,27.69 25.78,28.07 C46.2 26.6,28.83 28.83,28.83 30.54,30.54 31.14,30.54 31.31,30.71 31.31,32.54 30.99,32.86 R13.1
M1_PH: length 34.3
  Top Layer w0.254: v1(18.67,23.09) 18.67,23.36 18.22,23.81 18.22,24.29 18.27,24.34 U1.24 ; U4.2 44.81,28.73 44.89,28.65 44.96,28.65 v1(45.14,28.47)
  Bottom Layer w0.254: v1(18.67,23.09) 19.57,23.09 19.75,23.27 19.75,24.38 20.3,24.93 21.45,24.93 25.22,28.7 32.82,28.7 34.27,27.25 42.2,27.25 43.48,28.52 44.26,28.52 44.31,28.47 v1(45.14,28.47)
M2_EN: length 53.5
  Top Layer w0.254: v1(59.87,27.7) 59.68,27.88 59.63,27.88 59.43,28.08 U5.1 ; v1(18.16,20.85) 18.12,20.81 U1.38
  Bottom Layer w0.254: v1(18.16,20.85) 18.88,20.85 25.62,27.59 25.88,27.59 25.92,27.63 32.37,27.63 33.97,26.03 58.93,26.03 59.59,26.69 59.59,27.09 59.87,27.37 v1(59.87,27.7)
M2_ENCA: length 44.1
  Top Layer w0.254: v1(18.51,26.92) 18.69,26.75 18.69,26.49 18.85,26.32 19.11,26.32 19.27,26.16 U1.22
  Bottom Layer w0.254: v1(18.51,26.92) 21.09,26.92 21.81,27.65 21.81,28.96 23.71,30.86 23.71,36.26 25.13,37.67 48.35,37.67 CN3.5
M2_ENCB: length 42.7
  Top Layer w0.254: U1.23 18.77,24.09 v1(18.81,24.05)
  Bottom Layer w0.254: v1(18.81,24.05) 21.23,26.48 21.23,26.57 22.16,27.5 22.16,28.81 24.07,30.71 24.07,36.11 25.27,37.32 47.91,37.32 48.67,36.55 48.67,35.11 48.72,35.05 CN3.6
M2_IPROPI: length 15.8
  Top Layer w0.127: R14.1 26.22,36.25 26.22,31.18 25.59,30.54 23.57,30.54 22.48,29.45 22.21,29.45 21.59,28.83 C47.2 21.45,28.14 21.45,27.62 21.77,27.3 U1.17
M2_PH: length 51.8
  Top Layer w0.254: U1.25 17.84,25.19 17.84,23.69 17.91,23.62 v1(17.91,22.61) ; v1(59.87,28.47) 59.69,28.65 59.63,28.65 59.54,28.73 U5.2
  Bottom Layer w0.254: v1(59.87,28.47) 59.68,28.28 59.63,28.28 59.28,27.94 59.28,27.88 58.2,26.8 53.85,26.8 53.09,27.56 44.72,27.56 44.11,28.17 43.62,28.17 43.28,27.82 43.28,27.66 42.52,26.89 34.12,26.89 32.67,28.35 25.37,28.35 21.6,24.57 20.45,24.57 20.11,24.23 20.11,23.08 19.38,22.35 18.16,22.35 v1(17.91,22.61)
M3_EN: length 42.7
  Top Layer w0.254: U6.1 48.52,10.02 48.32,10.22 48.27,10.22 v1(48.08,10.4) ; U1.39 17.03,20.31 17.65,19.68 17.65,18.41 v1(17.91,18.16)
  Bottom Layer w0.254: v1(17.91,18.16) 18.01,18.16 18.8,17.37 18.83,17.37 19.66,16.53 21.62,16.53 22.63,15.52 22.63,14.32 24.64,12.32 46.17,12.32 v1(48.08,10.4)
M3_ENCA: length 56.2
  Top Layer w0.254: CN4.5 56.97,1.35 56.05,0.43 31.01,0.43 29.96,1.47 29.48,1.47 28.43,0.43 18.88,0.43 17.2,2.1 17.2,3.03 14.77,5.46 U1.50
M3_ENCB: length 56
  Top Layer w0.254: v1(55.75,1.4) 55.14,0.78 31.15,0.78 30.11,1.83 29.33,1.83 28.28,0.78 19.03,0.78 17.56,2.25 17.56,10.53 16.74,11.35 16.74,12.6 17.27,13.14 U1.55
  Bottom Layer w0.254: v1(55.75,1.4) 57.32,1.4 CN4.6
M3_IPROPI: length 15.1
  Top Layer w0.127: U1.9 23.02,19.81 22.87,19.66 21.71,19.66 21.16,19.11 21.16,16.06 23.98,13.23 24.42,13.23 C48.2 25.43,12.77 26.1,12.09 27.41,12.09 27.94,11.56 R15.1
M3_PH: length 39.6
  Top Layer w0.254: v1(16.89,14.99) 16.77,14.87 U1.54 ; v1(48.08,9.63) 48.26,9.45 48.32,9.45 48.41,9.37 U6.2
  Bottom Layer w0.254: v1(48.08,9.63) 41.16,9.63 39.49,11.3 35.75,11.3 34.67,10.22 33.27,10.22 33.27,10.22 33.11,10.22 32.77,9.87 32.77,9.71 32.38,9.32 19.24,9.32 16.89,11.67 v1(16.89,14.99)
M4_EN: length 28.2
  Top Layer w0.254: U1.40 16.77,19.81 17.14,19.43 v1(17.14,17.91) ; v1(33.35,11.03) 33.59,10.78 33.59,10.22 33.79,10.02 U7.1
  Bottom Layer w0.254: v1(33.35,11.03) 32.41,11.96 24.49,11.96 22.28,14.18 22.28,15.38 21.47,16.18 19.49,16.18 18.52,17.14 18.41,17.14 17.98,17.58 17.67,17.58 17.33,17.91 v1(17.14,17.91)
M4_ENCA: length 49.6
  Top Layer w0.254: U1.58 18.77,12.93 18.49,12.65 17.79,12.65 17.45,12.31 17.45,11.82 17.92,11.36 17.92,2.4 19.18,1.14 28.13,1.14 29.18,2.18 30.25,2.18 31.3,1.14 46.74,1.14 46.96,1.37 v1(47.47,1.37)
  Bottom Layer w0.254: 47.13,1.7 46.86,1.97 43.8,1.97 42.72,3.05 CN5.5 ; 47.13,1.7 v1(47.47,1.37)
M4_ENCB: length 47.4
  Top Layer w0.254: v1(47.37,2.29) 46.58,1.49 31.45,1.49 30.4,2.54 29.03,2.54 27.99,1.49 19.32,1.49 18.27,2.55 18.27,11 18.61,11.34 19.75,11.34 19.92,11.5 19.92,12.63 19.75,12.79 19.27,12.79 U1.59
  Bottom Layer w0.254: v1(47.37,2.29) 46.61,3.05 CN5.6
M4_IPROPI: length 13.8
  Top Layer w0.127: U1.8 21.85,19.31 21.51,18.97 21.51,16.22 24,13.74 24,13.72 24.13,13.59 25.85,13.59 25.93,13.5 25.93,13.21 26.14,13 26.43,13 C49.2 27.37,12.77 27.56,12.95 28.33,12.95 R16.1
M4_PH: length 22.1
  Top Layer w0.254: U1.53 16.27,12.82 v1(16.15,12.7) ; U7.2 33.67,9.37 33.59,9.45 33.53,9.45 v1(33.35,9.63)
  Bottom Layer w0.254: v1(16.15,12.7) 16.44,12.41 16.44,11.62 19.1,8.97 32.68,8.97 32.77,9.05 32.77,9.11 33.11,9.45 33.17,9.45 v1(33.35,9.63)
M5_EN: length 38.8
  Top Layer w0.254: v1(45.48,13.26) 45.23,13.5 45.23,14.47 45.04,14.67 U8.1 ; v1(16.54,19.08) 16.32,19.31 U1.41
  Bottom Layer w0.254: v1(16.54,19.08) 16.56,19.1 18.3,19.1 18.85,18.55 18.85,18.36 19.96,17.25 21.91,17.25 24.1,15.06 24.32,15.06 24.67,14.72 24.67,13.86 24.76,13.77 25.68,13.77 26.42,13.03 45.25,13.03 v1(45.48,13.26)
M5_IPROPI: length 15.6
  Top Layer w0.127: R17.1 32.48,22.48 32.39,22.39 32.39,21.84 32.16,21.61 32.16,20.29 C50.2 29.86,21.25 25.11,21.25 24.99,21.13 24.99,20.59 24.71,20.31 U1.10
M5_PH: length 25.2
  Top Layer w0.254: U1.2 24.43,16.31 24.75,15.99 24.75,15.73 24.8,15.68 24.8,15.68 25.27,15.21 27.1,15.21 v1(27.13,15.24) ; 44.23,15.32 45.15,15.32 45.23,15.23 45.3,15.23 v1(45.48,15.06)
  Bottom Layer w0.254: v1(45.48,15.06) 44.16,13.74 28.34,13.74 27.85,14.23 27.85,14.24 27.85,14.72 27.51,15.06 27.31,15.06 v1(27.13,15.24)
M6_EN: length 53.3
  Top Layer w0.254: v1(58.71,14.29) 58.53,14.47 58.47,14.47 58.28,14.67 U9.1 ; U1.42 15.86,18.81 v1(16.38,18.29)
  Bottom Layer w0.254: v1(58.71,14.29) 58.71,13.91 56.39,11.59 47.4,11.59 46.31,12.67 26.26,12.67 25.53,13.41 24.05,13.41 22.99,14.47 22.99,15.67 21.77,16.89 19.81,16.89 18.49,18.21 18.49,18.4 18.15,18.74 17.16,18.74 16.7,18.29 v1(16.38,18.29)
M6_IPROPI: length 28.4
  Top Layer w0.127: 49.44,23.72 32.61,23.72 32.13,23.24 32.13,23.19 32.16,23.16 32.16,21.94 31.5,21.27 31.28,21.48 25.02,21.48 24.76,21.22 24.76,20.97 24.6,20.81 U1.11
  Top Layer w0.254: R18.1 49.44,23.72
M6_PH: length 45.1
  Top Layer w0.254: v1(22.03,18.2) 21.84,18.02 21.84,17.02 22.05,16.81 U1.3 ; v1(58.71,15.06) 58.53,15.23 58.47,15.23 58.39,15.32 57.47,15.32
  Bottom Layer w0.254: v1(58.71,15.06) 58.53,14.87 58.47,14.87 58.13,14.53 58.13,14.47 56.99,13.33 46.23,13.33 45.72,13.84 45.21,13.84 44.76,13.39 26.56,13.39 24.43,15.52 24.14,15.52 23.05,16.61 23.05,17.84 22.69,18.2 v1(22.03,18.2)
NRST: length 21.4
  Top Layer w0.254: v1(20.64,18.79) 19.42,18.79 17.96,17.32 16.9,17.32 16.7,17.53 15.37,17.53 v1(14.73,16.89) ; U1.7 23.71,18.8 22.56,18.8 v1(22.55,18.79) ; v1(7.87,16.76) 6.92,16.76 C13.1 6.8,16.76 SW1.2
  Bottom Layer w0.254: v1(22.55,18.79) v1(20.64,18.79) ; v1(7.87,16.76) 8.51,16.13 8.51,15.24 8.69,15.06 11.76,15.06 13.03,16.33 14.17,16.33 v1(14.73,16.89)
NSLEEP: length 111.9
  Top Layer w0.254: v1(59.87,29.23) 59.72,29.38 U5.3 ; v1(58.71,15.82) 58.56,15.97 U9.3 ; U6.3 48.23,8.72 v1(48.08,8.87) ; U8.3 45.33,15.97 v1(45.48,15.82) ; v1(33.35,8.87) 33.5,8.72 U7.3 ; U4.3 44.99,29.38 v1(45.14,29.23) ; U1.52 15.77,14.88 v1(15.88,14.99)
  Bottom Layer w0.254: v1(45.48,15.82) 49.38,15.82 51.45,13.74 56.57,13.74 58.47,15.64 58.53,15.64 v1(58.71,15.82) ; v1(58.71,15.82) 58.73,15.82 58.91,15.64 58.95,15.64 59.3,15.3 59.3,15.25 59.31,15.24 59.31,13.08 57.18,10.95 50.63,10.95 50.08,10.4 50.08,9.21 49.74,8.87 v1(48.08,8.87) 41.42,8.87 39.34,10.95 35.9,10.95 33.82,8.87 v1(33.35,8.87) 33.09,8.61 18.95,8.61 15.95,11.61 15.95,11.93 15.57,12.31 15.57,12.94 15.88,13.25 v1(15.88,14.99) ; v1(58.71,15.82) 59.94,17.05 59.94,26.95 60.45,27.45 60.45,28.71 60.11,29.05 60.05,29.05 v1(59.87,29.23) 59.76,29.34 58.06,29.34 57.87,29.14 57.87,27.65 57.37,27.15 54,27.15 53.45,27.7 53.45,28.72 52.94,29.23 v1(45.14,29.23)
SWCLK: length 21.7
  Top Layer w0.254: H1.3 2.67,2.92 10.16,2.92 14.27,7.03 U1.49
SWDIO: length 18.4
  Top Layer w0.254: U1.46 11.45,16.81 11.42,16.84 10.81,16.84 10.78,16.81 8.93,16.81 7.75,15.62 7.75,11.3 6.98,10.54 4.32,10.54 3.05,9.27 3.05,7.94 1.71,6.6 H1.2
USB_DN: length 13.4
  Top Layer w0.254: USB1.B7 6.12,24.55 6.74,24.55 6.9,24.39 6.9,23.86 6.74,23.7 6.19,23.7 6.14,23.65 6.07,23.65 USB1.A7 6.87,23.63 6.92,23.58 7.34,23.58 7.48,23.45 9.13,23.45 9.55,23.03 9.55,19.25 11.04,17.76 11.3,17.76 11.34,17.81 U1.44
USB_DP: length 13.4
  Top Layer w0.254: U1.45 11.34,17.31 11.3,17.35 10.87,17.35 9.14,19.08 9.14,22.86 8.96,23.04 7.31,23.04 7.18,23.17 6.92,23.17 6.87,23.13 USB1.B6 5.97,23.2 5.36,23.2 5.19,23.36 5.19,23.89 5.36,24.05 5.97,24.05 USB1.A6
VCAP: length 26.5
  Top Layer w0.254: v1(14.35,27.05) C3.2 15.3,25.29 U1.30 ; v1(21.57,12.06) 20.64,12.06 20.77,12.2 U1.62
  Bottom Layer w0.254: v1(21.57,12.06) 21.57,12.61 22.01,13.05 22.01,13.94 21.92,14.03 21.92,15.23 21.32,15.82 19.34,15.82 18.37,16.79 18.27,16.79 17.91,17.14 16.03,17.14 15.25,17.92 15.25,18.4 15.33,18.48 15.33,23.17 15.24,23.27 15.24,23.75 15.33,23.84 15.33,23.86 15.36,23.89 15.36,24.37 15.24,24.49 15.24,26.16 14.96,26.44 14.96,26.74 14.65,27.05 v1(14.35,27.05)
$1N5317: length 2.2
  Top Layer w0.254: USB1.B5 8.22,22.13 R2.1
$1N5479: length 2.2
  Top Layer w0.254: R1.1 8.23,25.13 USB1.A5
$2N8125: length 22.6
  Top Layer w0.127: R13.2 30.99,35.69 31.5,36.19 45.59,36.19 46.3,35.48 46.3,31.71 R4.2
  Top Layer w0.254: R4.2 45.26,31.33 U4.6
$2N8729: length 40.9
  Top Layer w0.127: R5.2 60.32,31.27 61.04,31.98 61.04,32.09 61.09,32.14 61.09,36.19 60.73,36.55 29.68,36.55 29.45,36.78 28.26,36.78 R14.2
  Top Layer w0.254: U5.6 59.99,31.33 R5.2
$2N8744: length 32.8
  Top Layer w0.127: R6.2 47.62,6.83 46.91,6.12 46.91,4.11 46.86,4.06 46.86,3.17 45.54,1.85 32.57,1.85 31.88,2.54 31.88,8.46 32.05,8.64 32.05,11.08 31.58,11.56 R15.2
  Top Layer w0.254: R6.2 47.96,6.77 U6.6
$2N8759: length 10.3
  Top Layer w0.127: R7.2 32.45,7.1 32.23,7.32 32.23,8.31 32.41,8.49 32.41,12.08 31.41,13.08 R16.2
  Top Layer w0.254: U7.6 33.22,6.77 R7.2
$2N8774: length 17.7
  Top Layer w0.127: R8.2 46.86,18.52 46.86,22.86 46.35,23.37 38.09,23.37 R17.2
  Top Layer w0.254: U8.6 45.6,17.92 R8.2
$2N8789: length 17.7
  Top Layer w0.127: R9.2 60.74,19.15 60.74,22.89 60.07,23.56 51.23,23.56 R18.2
  Top Layer w0.254: U9.6 58.84,17.92 R9.2
$2N8796: length 3.2
  Top Layer w0.254: R11.1 R10.2 R12.1

## Copper pours and planes (outline as drawn; the poured copper is in the pictures)
3V3 on Top Layer: 0.25,37.72 2.54,37.72 2.54,32.99 5.92,32.99 5.92,31.09 2.54,31.09 2.54,29.15 0.25,29.15
3V3 on Top Layer: 0.38,36.19 8.51,36.19 8.51,32.64 0.38,32.64
3V3 on Top Layer: 0.38,35.43 8.51,35.43 8.51,32.64 0.38,32.64
3V3 on Inner2: 0.26,37.84 31.6,37.84 31.6,0.26 0.26,0.26
GND on Top Layer: 35.56,8.89 35.56,10.41 41.78,10.41 41.78,9.52 41.15,8.89
GND on Top Layer: 43.27,15.8 43.27,14.28 37.48,14.28 37.48,15.18 37.68,15.8
GND on Top Layer: 39.37,5.84 39.37,3.93 46.28,3.93 46.28,6.57 45.11,6.68 45.11,5.26 43.02,5.26 43.02,5.97 41.35,5.97 41.2,5.84
GND on Top Layer: 5.97,32.64 8.64,32.64 8.64,35.43 10.81,35.43 10.81,28.96 2.67,28.96 2.67,30.92 5.97,30.92
GND on Top Layer: 54.1,5.84 54.1,3.93 61.01,3.93 61.01,6.57 59.84,6.68 59.84,5.26 57.75,5.26 57.75,5.97 56.08,5.97 55.93,5.84
GND on Top Layer: 50.29,8.89 50.29,10.41 56.51,10.41 56.51,9.52 55.88,8.89
GND on Top Layer: 57.66,29.21 57.66,27.69 51.44,27.69 51.44,28.58 52.07,29.21
GND on Top Layer: 39.12,32.26 39.12,34.16 32.21,34.16 32.21,31.53 33.38,31.42 33.38,32.84 35.47,32.84 35.47,32.13 37.14,32.13 37.29,32.26
GND on Top Layer: 53.85,32.26 53.85,34.16 46.94,34.16 46.94,31.53 48.11,31.42 48.11,32.84 50.2,32.84 50.2,32.13 51.87,32.13 52.02,32.26
GND on Top Layer: 42.93,29.21 42.93,27.69 36.7,27.69 36.7,28.58 37.34,29.21
GND on Top Layer: 37.49,18.97 37.23,19.23 34.27,19.23 34.27,20.39 34.38,20.5 39.47,20.5 39.47,18.97
GND on Top Layer: 6.81,19.05 0.3,19.05 0.3,21.08 6.81,21.08
GND on Top Layer: 50.72,18.97 50.47,19.23 47.51,19.23 47.51,20.39 47.61,20.5 52.7,20.5 52.7,18.97
GND on Top Layer: 6.73,26.67 0.22,26.67 0.22,28.7 6.73,28.7
GND on Top Layer: 61.47,37.97 75.95,37.97 75.95,0.25 61.47,0.25
GND on Top Layer: 56.5,15.8 56.5,14.28 50.71,14.28 50.71,15.18 50.91,15.8
GND on Bottom Layer: 61.47,37.97 75.95,37.97 75.95,0.25 61.47,0.25
GND on Inner1: 0.26,37.84 75.94,37.84 75.94,0.26 0.26,0.26
VBATT on Top Layer: 53.98,30.77 53.98,31.49 53.97,31.5 51.94,31.5 51.94,32.03 51.38,32.03 50.86,31.62 49.95,31.62 49.96,32.7 48.39,32.72 48.39,29.89 51.14,29.89 51.99,30.74 51.99,30.77
VBATT on Top Layer: 53.97,7.33 53.97,6.61 53.98,6.6 56.01,6.6 56.01,6.07 56.57,6.07 57.09,6.48 58,6.48 57.99,5.4 59.56,5.38 59.56,8.21 56.81,8.21 55.96,7.36 55.96,7.33
VBATT on Top Layer: 39.24,7.33 39.24,6.61 39.25,6.6 41.28,6.6 41.28,6.07 41.84,6.07 42.36,6.48 43.27,6.48 43.25,5.4 44.83,5.38 44.83,8.21 42.08,8.21 41.23,7.36 41.23,7.33
VBATT on Top Layer: 39.25,30.77 39.25,31.49 39.24,31.5 37.21,31.5 37.21,32.03 36.65,32.03 36.13,31.62 35.22,31.62 35.23,32.7 33.66,32.72 33.66,29.89 36.41,29.89 37.26,30.74 37.26,30.77
VBATT on Top Layer: 52.69,18.21 50.79,18.21 50.79,19.1 47.35,19.1 47.36,19.1 47.36,17.32 50.65,17.32 50.66,17.34 50.66,17.58 52.69,17.58
VBATT on Top Layer: 71.3,23.08 74.93,23.08 74.93,12.32 71.3,12.32
VBATT on Top Layer: 39.46,18.21 37.55,18.21 37.55,19.1 34.12,19.1 34.12,19.1 34.12,17.32 37.41,17.32 37.42,17.34 37.42,17.58 39.46,17.58
VBATT on Bottom Layer: 71.3,23.08 74.93,23.08 74.93,12.32 71.3,12.32
VBATT on Inner2: 32.24,37.84 75.94,37.84 75.94,0.26 32.24,0.26
VBUS on Top Layer: 6.73,26.67 6.73,25.66 4.83,24.92 4.83,22.8 6.73,22.08 6.73,21.03 3.35,21.03 3.3,21.08 3.3,26.68 6.74,26.68
VBUS on Top Layer: 5.91,37.74 10.81,37.74 10.81,35.96 5.91,35.96
$2I4343\OUT1 on Top Layer: 44.83,32.26 42.79,32.26 42.79,34.01 43.18,34.39 43.18,36.07 45.3,36.07 45.3,34.04 44.83,33.57
$2I4343\OUT2 on Top Layer: 37.34,31.72 39.5,31.72 39.62,31.75 40.07,32.3 42.59,32.3 42.59,33.91 43.1,34.42 43.18,34.42 43.18,36.07 41.28,36.07 41.28,34.5 39.79,33.02 39.79,32.93 39.41,32.93 39.37,32.89 39.12,32.89 39.12,32.29 37.34,32.29
$2I4381\OUT1 on Top Layer: 59.56,32.26 57.52,32.26 57.52,34.01 57.91,34.39 57.91,36.07 60.03,36.07 60.03,34.04 59.56,33.57
$2I4381\OUT2 on Top Layer: 52.07,31.72 54.23,31.72 54.36,31.75 54.8,32.3 57.32,32.3 57.32,33.91 57.83,34.42 57.91,34.42 57.91,36.07 56.01,36.07 56.01,34.5 54.53,33.02 54.53,32.93 54.14,32.93 54.1,32.89 53.85,32.89 53.85,32.29 52.07,32.29
$2I4419\OUT1 on Top Layer: 48.39,5.84 50.43,5.84 50.43,4.09 50.04,3.71 50.04,2.03 47.92,2.03 47.92,4.06 48.39,4.53
$2I4419\OUT2 on Top Layer: 55.88,6.38 53.72,6.38 53.59,6.35 53.15,5.8 50.63,5.8 50.63,4.19 50.12,3.68 50.04,3.68 50.04,2.03 51.94,2.03 51.94,3.6 53.42,5.08 53.42,5.17 53.81,5.17 53.85,5.21 54.1,5.21 54.1,5.81 55.88,5.81
$2I4457\OUT1 on Top Layer: 33.66,5.84 35.69,5.84 35.69,4.09 35.31,3.71 35.31,2.03 33.19,2.03 33.19,4.06 33.66,4.53
$2I4457\OUT2 on Top Layer: 41.15,6.38 38.99,6.38 38.86,6.35 38.42,5.8 35.89,5.8 35.89,4.19 35.39,3.68 35.31,3.68 35.31,2.03 37.21,2.03 37.21,3.6 38.69,5.08 38.69,5.17 39.08,5.17 39.12,5.21 39.37,5.21 39.37,5.81 41.15,5.81
$2I4533\OUT1 on Top Layer: 45.17,18.85 43.13,18.85 43.13,20.6 43.52,20.98 43.52,22.66 45.64,22.66 45.64,20.63 45.17,20.16
$2I4533\OUT2 on Top Layer: 37.68,18.3 40.14,18.3 40.14,18.74 42.68,18.89 42.68,20.5 43.19,21.01 43.27,21.01 43.27,22.66 41.36,22.66 41.36,21.09 39.88,19.61 39.88,19.52 39.49,19.52 39.46,19.48 39.46,19.1 39.2,18.88 37.68,18.88
$2I4563\OUT1 on Top Layer: 58.41,18.85 56.37,18.85 56.37,20.6 56.76,20.98 56.76,22.66 58.87,22.66 58.87,20.63 58.41,20.16
$2I4563\OUT2 on Top Layer: 50.91,18.3 53.38,18.3 53.38,18.74 55.91,18.89 55.91,20.5 56.42,21.01 56.5,21.01 56.5,22.66 54.6,22.66 54.6,21.09 53.12,19.61 53.12,19.52 52.73,19.52 52.69,19.48 52.69,19.1 52.44,18.88 50.91,18.88

Small or netless copper shapes (teardrops, artwork), in the pictures only: 78 on Inner1, 40 on Inner2

## Text on the board
Top Silkscreen Layer: RESET | BOOT | 3V3 | SWDIO | SWCLK | GND | PB8 | PC15 | PB4 | PB5 | VBUS | PA10 | ACC_VREF | DRV_VREF | John Ratke 2026 | IEEE Robotics @ UTD | IMU | Motor Driver Board v5.3 | MOTOR 1 | MOTOR 4 | MOTOR 2 | MOTOR 3 | MOTOR 5 | MOTOR 6
